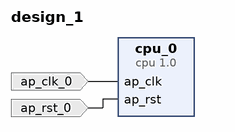
[diagram p0: block diagram of the top level]
# Vivado block design design_1, xc7z020clg400-1, Vivado 2025.1
create_bd_design design_1

create_bd_port -dir I -type clk ap_clk_0
create_bd_port -dir I -type rst ap_rst_0
set_property -dict {CONFIG.POLARITY ACTIVE_HIGH} [get_bd_ports ap_rst_0]

create_bd_cell -type ip -vlnv xilinx.com:hls:cpu:1.0 cpu_0

# ---- connections ----

connect_bd_net -net ap_clk_0_1 [get_bd_ports ap_clk_0] [get_bd_pins cpu_0/ap_clk]
connect_bd_net -net ap_rst_0_1 [get_bd_ports ap_rst_0] [get_bd_pins cpu_0/ap_rst]

validate_bd_design
save_bd_design
